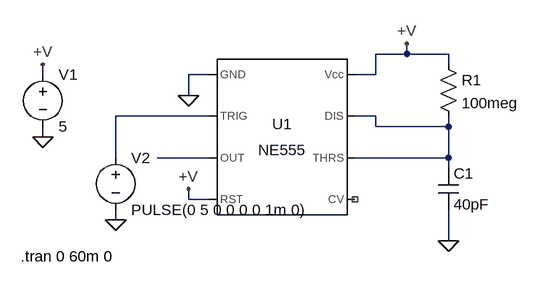
[diagram p0: schematic capacimetro pwm.asc]
capacimetro pwm.asc, the LTspice schematic file:
Version 4
SHEET 1 880 680
WIRE 336 16 336 0
WIRE 336 16 288 16
WIRE 400 16 336 16
WIRE 400 32 400 16
WIRE -224 48 -224 32
WIRE 32 48 0 48
WIRE 288 48 288 16
WIRE 288 48 256 48
WIRE 0 80 0 48
WIRE 32 112 -112 112
WIRE 288 112 256 112
WIRE 288 128 288 112
WIRE 400 128 400 112
WIRE 400 128 288 128
WIRE -224 144 -224 128
WIRE -112 176 -112 112
WIRE 32 176 -48 176
WIRE 400 176 400 128
WIRE 400 176 256 176
WIRE 400 192 400 176
WIRE 0 240 0 224
WIRE 32 240 0 240
WIRE -112 272 -112 256
WIRE 400 304 400 256
FLAG -224 144 0
FLAG -224 32 +V
FLAG 400 304 0
FLAG 0 80 0
FLAG 336 0 +V
FLAG 0 224 +V
FLAG -112 272 0
SYMBOL Misc\\NE555 144 144 R0
SYMATTR InstName U1
SYMBOL voltage -224 32 R0
WINDOW 123 0 0 Left 2
WINDOW 39 0 0 Left 2
SYMATTR InstName V1
SYMATTR Value 5
SYMATTR Value2 ""
SYMATTR SpiceLine ""
SYMBOL res 384 16 R0
SYMATTR InstName R1
SYMATTR Value 100meg
SYMATTR SpiceLine ""
SYMBOL cap 384 192 R0
SYMATTR InstName C1
SYMATTR Value 40pF
SYMBOL voltage -112 160 R0
WINDOW 123 0 0 Left 2
WINDOW 39 0 0 Left 2
SYMATTR InstName V2
SYMATTR Value PULSE(0 5 0 0 0 0 1m 0)
SYMATTR Value2 ""
SYMATTR SpiceLine ""
TEXT -258 328 Left 2 !.tran 0 60m 0

The netlist it stands for:
* capacimetro pwm.asc
XU1 0 N001 N003 +V NC_01 N002 N002 +V NE555  ; pins GND TRIG OUT RST CV THRS DIS Vcc
V1 +V 0 5
R1 +V N002 100meg
C1 N002 0 40pF
V2 N001 0 PULSE(0 5 0 0 0 0 1m 0)
.tran 0 60m 0
.lib NE555.sub
.backanno
.end